# Altium schematic sheet 03_Dimmer.SchDoc: LED Dimmer
size A4; SheetNumber: 1; SheetTotal: 3; PageSetup: Record=PageOptions|CenterHorizontal=True|CenterVertical=True|PrintScale=1.09|XCorrection=1.00|YCorrection=1.00|PrintKind=0|BorderSize=5000000|LeftOffset=0|BottomOffset=0|Orientation=2|PaperLength=1000|PaperWidth=1000|Scale=100|PaperSource=7|PrintQuality=-3|MediaType=1|DitherType=10|PrintScaleMode=1|PaperKind=A4|PaperIndex=9; SK_ProjectName: ESP8266 IoT Dimmer; Version: R01
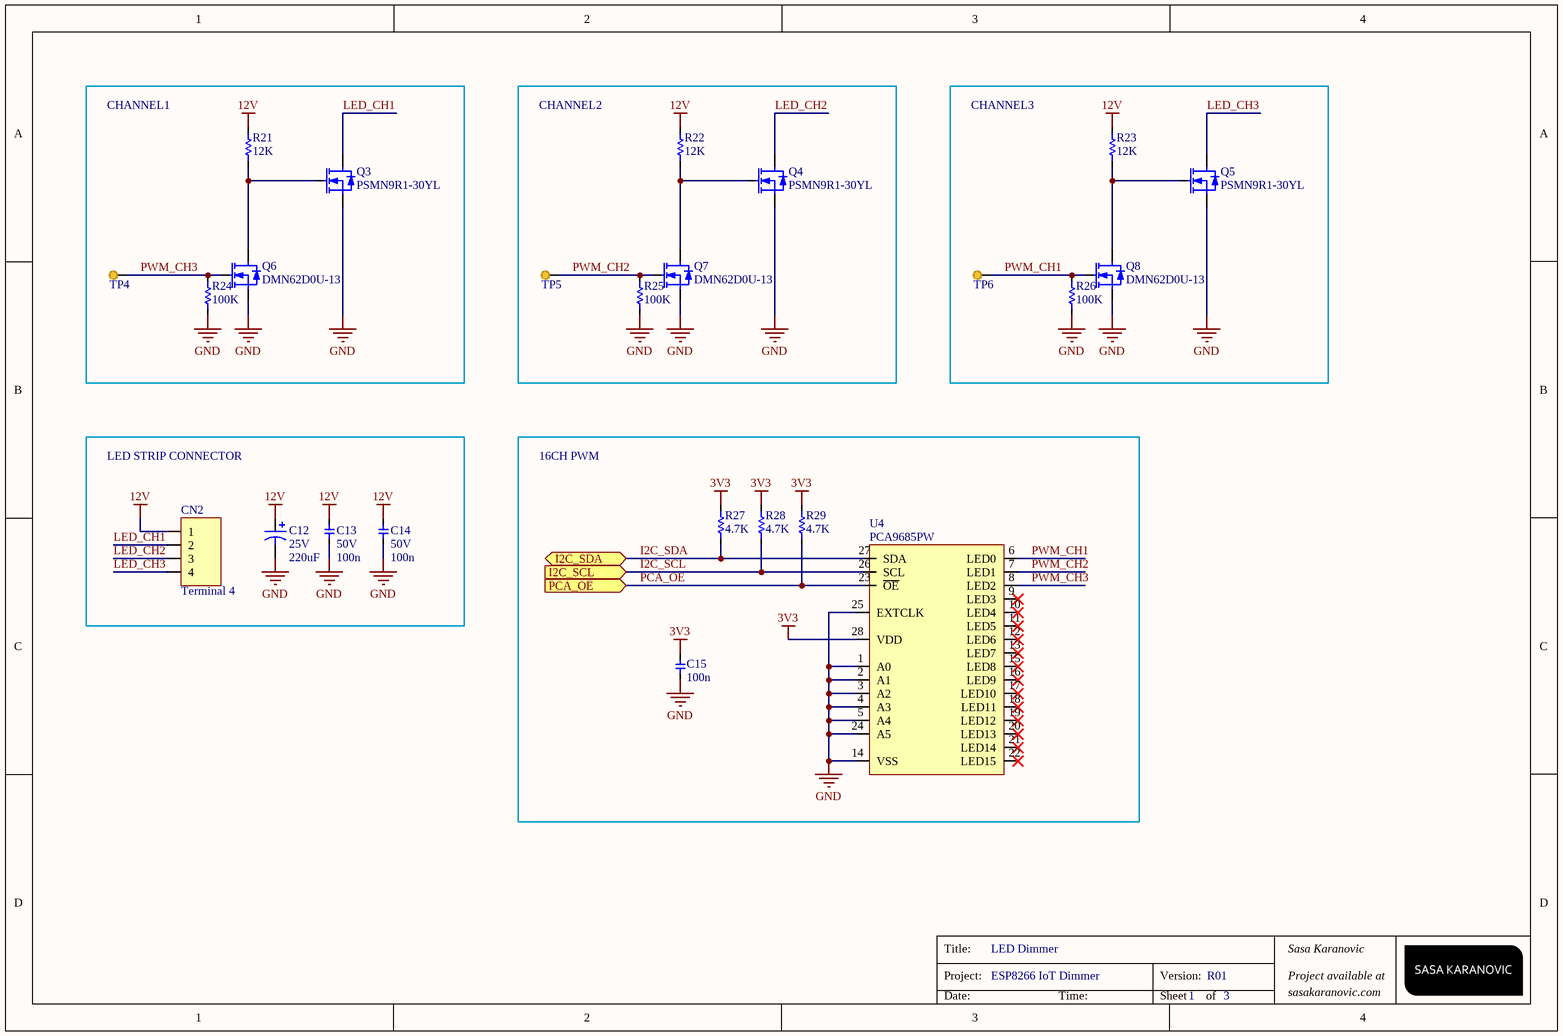
[diagram p0: 03_Dimmer.SchDoc]

## Parts
C12  25V  value 220uF  [Electrolytic Cap 2.54mm]
C13  50V  value 100n  [0603 - CAP]
C14  50V  value 100n  [0603 - CAP]
C15  value 100n  [0603 - CAP]  (hidden comment: Cap)
CN2  Terminal 4  [Terminal 4_90DEG]
Q3  PSMN9R1-30YL  [LFPAK-8]
Q4  PSMN9R1-30YL  [LFPAK-8]
Q5  PSMN9R1-30YL  [LFPAK-8]
Q6  DMN62D0U-13  [SOT90P240X100-3N]
Q7  DMN62D0U-13  [SOT90P240X100-3N]
Q8  DMN62D0U-13  [SOT90P240X100-3N]
R21  value 12K  [0603]  (hidden comment: Res)
R22  value 12K  [0603]  (hidden comment: Res)
R23  value 12K  [0603]  (hidden comment: Res)
R24  value 100K  [0603]  (hidden comment: Res)
R25  value 100K  [0603]  (hidden comment: Res)
R26  value 100K  [0603]  (hidden comment: Res)
R27  value 4.7K  [0603]  (hidden comment: Res)
R28  value 4.7K  [0603]  (hidden comment: Res)
R29  value 4.7K  [0603]  (hidden comment: Res)
TP4  Test Point 0.6mm  [TP_SMD_1mm]  (value not drawn)  (no BOM)
TP5  Test Point 0.6mm  [TP_SMD_1mm]  (value not drawn)  (no BOM)
TP6  Test Point 0.6mm  [TP_SMD_1mm]  (value not drawn)  (no BOM)
U4  PCA9685PW  [TSOP65P640X100-28N]

## Blocks framed on the sheet
CHANNEL1: Q3 Q6 R21 R24 TP4
CHANNEL2: Q4 Q7 R22 R25 TP5
CHANNEL3: Q5 Q8 R23 R26 TP6
LED STRIP CONNECTOR: C12-C14 CN2
16CH PWM: C15 R27-R29 U4

## Ports
I2C_SCL (in), I2C_SDA (bidir), PCA_OE (in)

## Nets
3V3: C15.2 R27.2 R28.2 R29.2 U4.28(VDD)
12V: C12.1 C13.2 C14.2 CN2.1 R21.2 R22.2 R23.2
GND: C12.2 C13.1 C14.1 C15.1 Q3.S Q4.S Q5.S Q6.3(S) Q7.3(S) Q8.3(S) R24.1 R25.1 R26.1 U4.1(A0) U4.2(A1) U4.3(A2) U4.4(A3) U4.5(A4) U4.14(VSS) U4.24(A5) U4.25(EXTCLK)
I2C_SCL: R28.1 U4.26(SCL) ; port I2C_SCL
I2C_SDA: R27.1 U4.27(SDA) ; port I2C_SDA
LED_CH1: CN2.2 Q3.D
LED_CH2: CN2.3 Q4.D
LED_CH3: CN2.4 Q5.D
PCA_OE: R29.1 U4.23(~{OE}) ; port PCA_OE
PWM_CH1: Q8.1(G) R26.2 TP6.1 U4.6(LED0)
PWM_CH2: Q7.1(G) R25.2 TP5.1 U4.7(LED1)
PWM_CH3: Q6.1(G) R24.2 TP4.1 U4.8(LED2)
NetQ3_G: Q3.G Q6.2(D) R21.1
NetQ4_G: Q4.G Q7.2(D) R22.1
NetQ5_G: Q5.G Q8.2(D) R23.1

Not connected (* = marked no-connect by the designer): U4 9(LED3)* 10(LED4)* 11(LED5)* 12(LED6)* 13(LED7)* 15(LED8)* 16(LED9)* 17(LED10)* 18(LED11)* 19(LED12)* 20(LED13)* 21(LED14)* 22(LED15)*

## Notes on the sheet
- Title:
- Project:
- Version:
- sasakaranovic.com
- Sasa Karanovic
- Project available at
- Date:
- Time:
- Sheet
- of

## Library data of the parts
C12 = Cap Electrolytic: Polarized Capacitor (Axial); Manufacturer: Yageo; Manufacturer Part Number: AC0603FR-07470RL; Distributor: DigiKey; Distributor Part Number: 311-470LDCT-ND
C13-C15 = Cap: Capacitor; Manufacturer: AVX Corporation; Manufacturer Part Number: 06035C104KAT2A; Distributor Part Number: 478-5052-1-ND; Distributor: DigiKey
CN2 = Terminal 4: TERM BLOCK PCB 4POS 5.0MM GREEN; Manufacturer: Phoenix Contact; Manufacturer Part Number: 1935187; Distributor: DigiKey; Distributor Part Number: 277-1579-ND
Q3-Q5 = PSMN9R1-30YL: MOSFET N-CH 30V 37A LFPAK; Manufacturer: Nexperia USA Inc.; Manufacturer Part Number: PSMN011-30YLC,115; Distributor: DigiKey; Distributor Part Number: 1727-6495-1-ND
Q6-Q8 = DMN62D0U-13: MOSFET N-CH 60V 0.38A; pin to pad: 1>2 2>3 3>1; Manufacturer: Diodes Incorporated; Manufacturer Part Number: DMN62D0U-13; Distributor: DigiKey; Distributor Part Number: DMN62D0U-13DICT-ND
R21-R23 = Res: Resistor; Manufacturer: Yageo; Manufacturer Part Number: RT0603FRE0712KL; Distributor: DigiKey; Distributor Part Number: YAG3353TR-ND
R24-R26 = Res: Resistor; Manufacturer: Yageo; Manufacturer Part Number: RT0603BRD07100KL; Distributor: DigiKey; Distributor Part Number: YAG1235CT-ND
R27-R29 = Res: Resistor; Manufacturer: Yageo; Manufacturer Part Number: RT0603FRE074K7L; Distributor: DigiKey; Distributor Part Number: YAG1238CT-ND
TP4-TP6 = TP
U4 = PCA9685: IC LED DRIVER RGBA 28-TSSOP; Manufacturer: NXP USA Inc.; Manufacturer Part Number: PCA9685PW,118; Distributor: DigiKey; Distributor Part Number: 568-11925-1-ND